# EAGLE design outin_shield_pi (EAGLE 7.3.0)
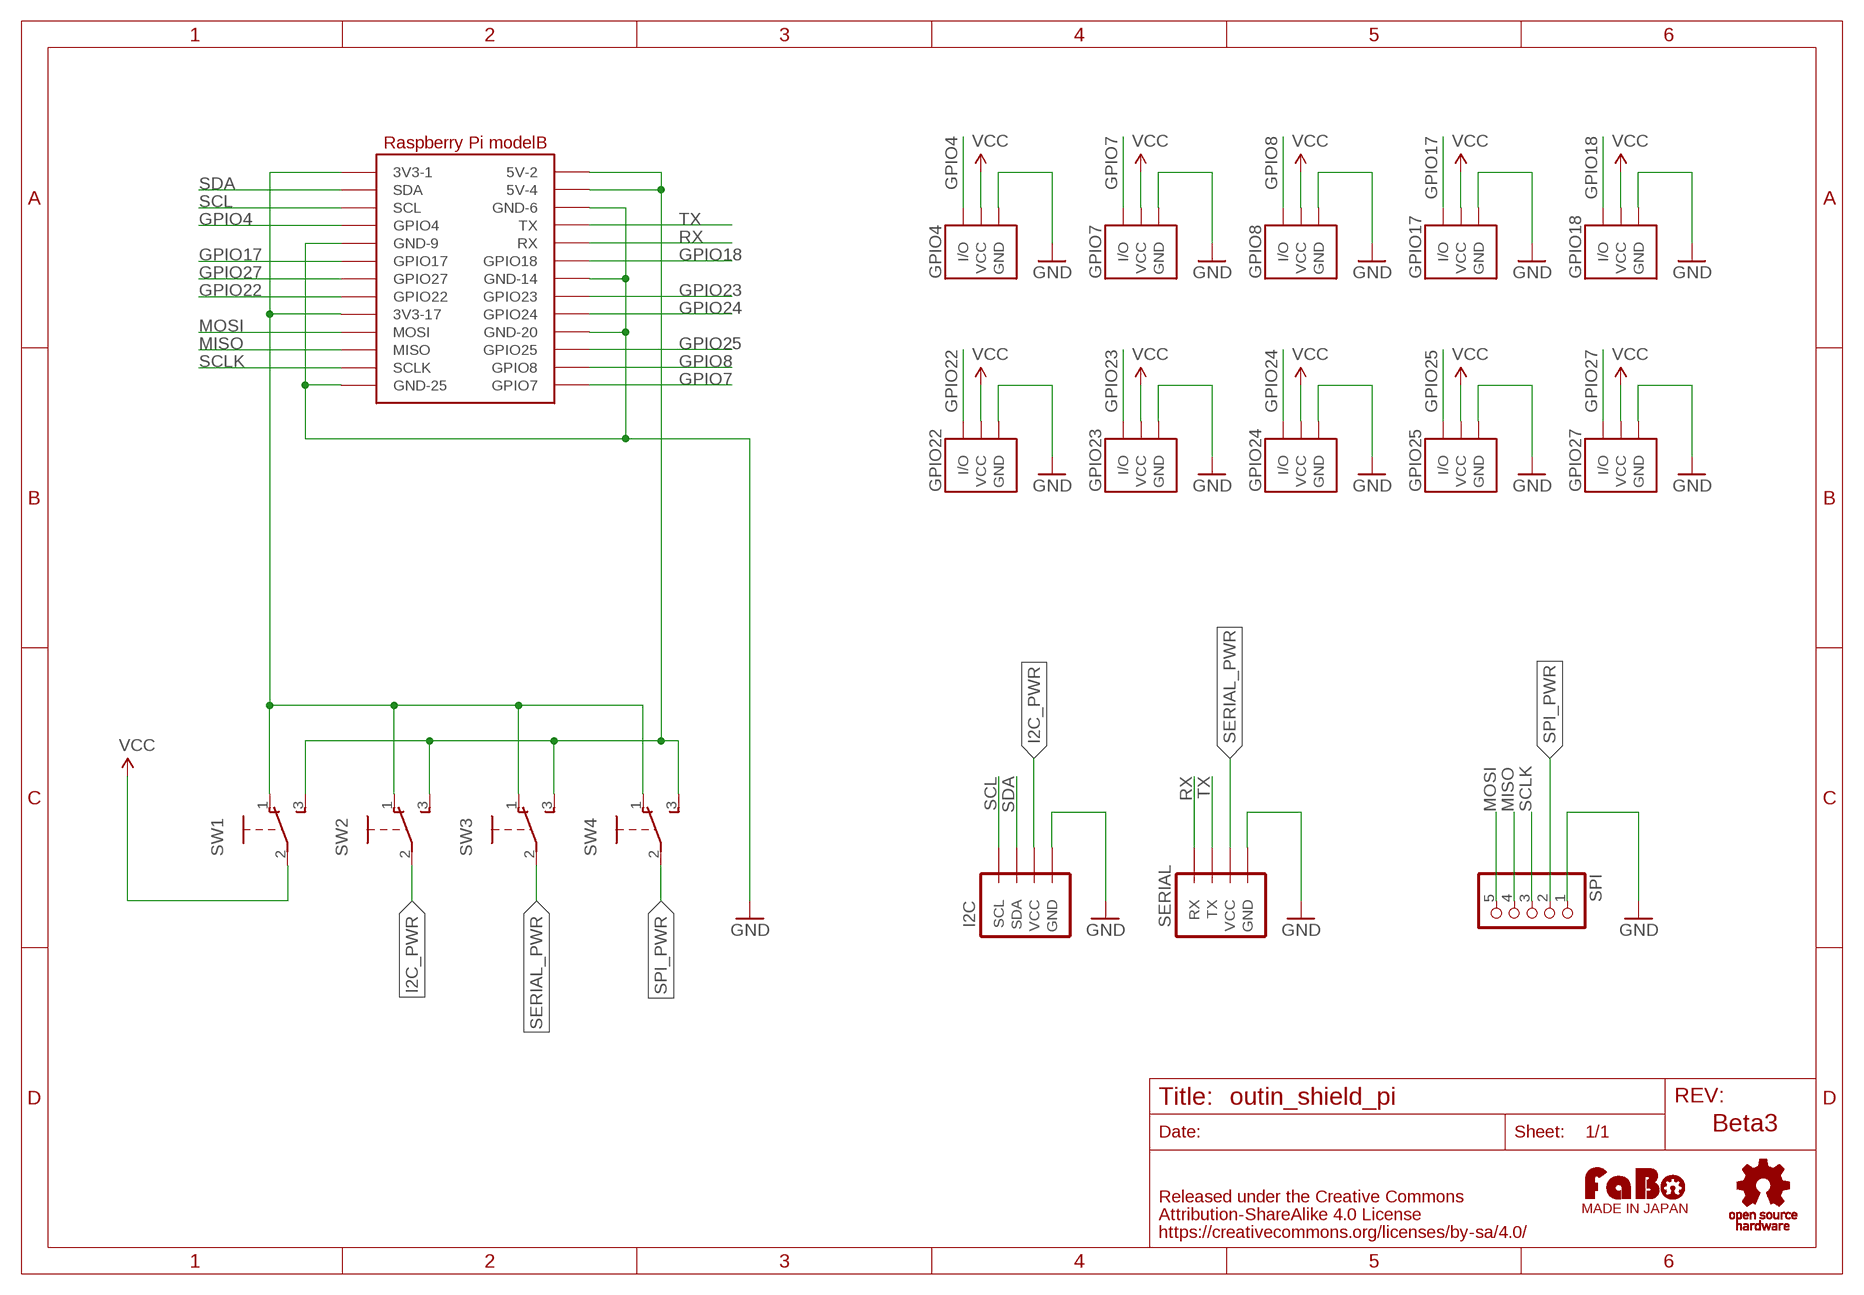
[diagram p0: schematic, sheet 1]

## Parts
GPIO4  IO_PIN-3PIN  [1X3-SNEAKY]
GPIO7  IO_PIN-3PIN  [1X3-SNEAKY]
GPIO8  IO_PIN-3PIN  [1X3-SNEAKY]
GPIO17  IO_PIN-3PIN  [1X3-SNEAKY]
GPIO18  IO_PIN-3PIN  [1X3-SNEAKY]
GPIO22  IO_PIN-3PIN  [1X3-SNEAKY]
GPIO23  IO_PIN-3PIN  [1X3-SNEAKY]
GPIO24  IO_PIN-3PIN  [1X3-SNEAKY]
GPIO25  IO_PIN-3PIN  [1X3-SNEAKY]
GPIO27  IO_PIN-3PIN  [1X3-SNEAKY]
I2C  BRICK_I2C_CONNECTOR  [BRICK_I2C_CONNECTOR]
SERIAL  BRICK_SERIAL_CONNECTOR  [BRICK_SERIAL_CONNECTOR]
SPI  PINHD-1X5  [1X05]
SW1  SWITCH-SLIDE-EG1218  [EG1218]
SW2  SWITCH-SLIDE-EG1218  [EG1218]
SW3  SWITCH-SLIDE-EG1218  [EG1218]
SW4  SWITCH-SLIDE-EG1218  [EG1218]
U1  RASPBERRY_PI_B1  [RASPBERRY_PI_B]
U$14  LOGO_FABO-M  [LOGO_FABO_M]
U$15  LOGO_OSHW_T-M  [LOGO_OSHW_T_M]

## Nets
3V3: SW1.1 SW2.1 SW3.1 SW4.1 U1.1(3V3-1) U1.17(3V3-17)
5V: SW1.3 SW2.3 SW3.3 SW4.3 U1.2(5V-2) U1.4(5V-4)
GND: GPIO4.1(GND) GPIO7.1(GND) GPIO8.1(GND) GPIO17.1(GND) GPIO18.1(GND) GPIO22.1(GND) GPIO23.1(GND) GPIO24.1(GND) GPIO25.1(GND) GPIO27.1(GND) I2C.GND SERIAL.GND SPI.1 U1.6(GND-6) U1.9(GND-9) U1.14(GND-14) U1.20(GND-20) U1.25(GND-25)
GPIO4: GPIO4.3(I/O) U1.7(GPIO4)
GPIO7: GPIO7.3(I/O) U1.26(GPIO7)
GPIO8: GPIO8.3(I/O) U1.24(GPIO8)
GPIO17: GPIO17.3(I/O) U1.11(GPIO17)
GPIO18: GPIO18.3(I/O) U1.12(GPIO18)
GPIO22: GPIO22.3(I/O) U1.15(GPIO22)
GPIO23: GPIO23.3(I/O) U1.16(GPIO23)
GPIO24: GPIO24.3(I/O) U1.18(GPIO24)
GPIO25: GPIO25.3(I/O) U1.22(GPIO25)
GPIO27: GPIO27.3(I/O) U1.13(GPIO27)
I2C_PWR: I2C.VCC SW2.2
MISO: SPI.4 U1.21(MISO)
MOSI: SPI.5 U1.19(MOSI)
RX: SERIAL.RX U1.10(RX)
SCL: I2C.SCL U1.5(SCL)
SCLK: SPI.3 U1.23(SCLK)
SDA: I2C.SDA U1.3(SDA)
SERIAL_PWR: SERIAL.VCC SW3.2
SPI_PWR: SPI.2 SW4.2
TX: SERIAL.TX U1.8(TX)
VCC: GPIO4.2(VCC) GPIO7.2(VCC) GPIO8.2(VCC) GPIO17.2(VCC) GPIO18.2(VCC) GPIO22.2(VCC) GPIO23.2(VCC) GPIO24.2(VCC) GPIO25.2(VCC) GPIO27.2(VCC) SW1.2

## Notes on the sheet
- Beta3
- MADE IN JAPAN

## Library data of the parts
GPIO4 GPIO7 GPIO8 GPIO17 GPIO18 GPIO22-GPIO25 GPIO27 = Gclue:IO_PIN
I2C = Gclue:BRICK_I2C_CONNECTOR: Brick Connector female for OUT/IN Shield
SERIAL = Gclue:BRICK_SERIAL_CONNECTOR
SPI = pinhead:PINHD-1X5: PIN HEADER
SW1-SW4 = Gclue:SWITCH-SLIDE
U1 = Gclue:RASPBERRY_PI_B
U$14 = FaBo:LOGO_FABO
U$15 = Gclue:LOGO_OSHW_T

## Net classes
0 default: width 0.254 mm

## Board
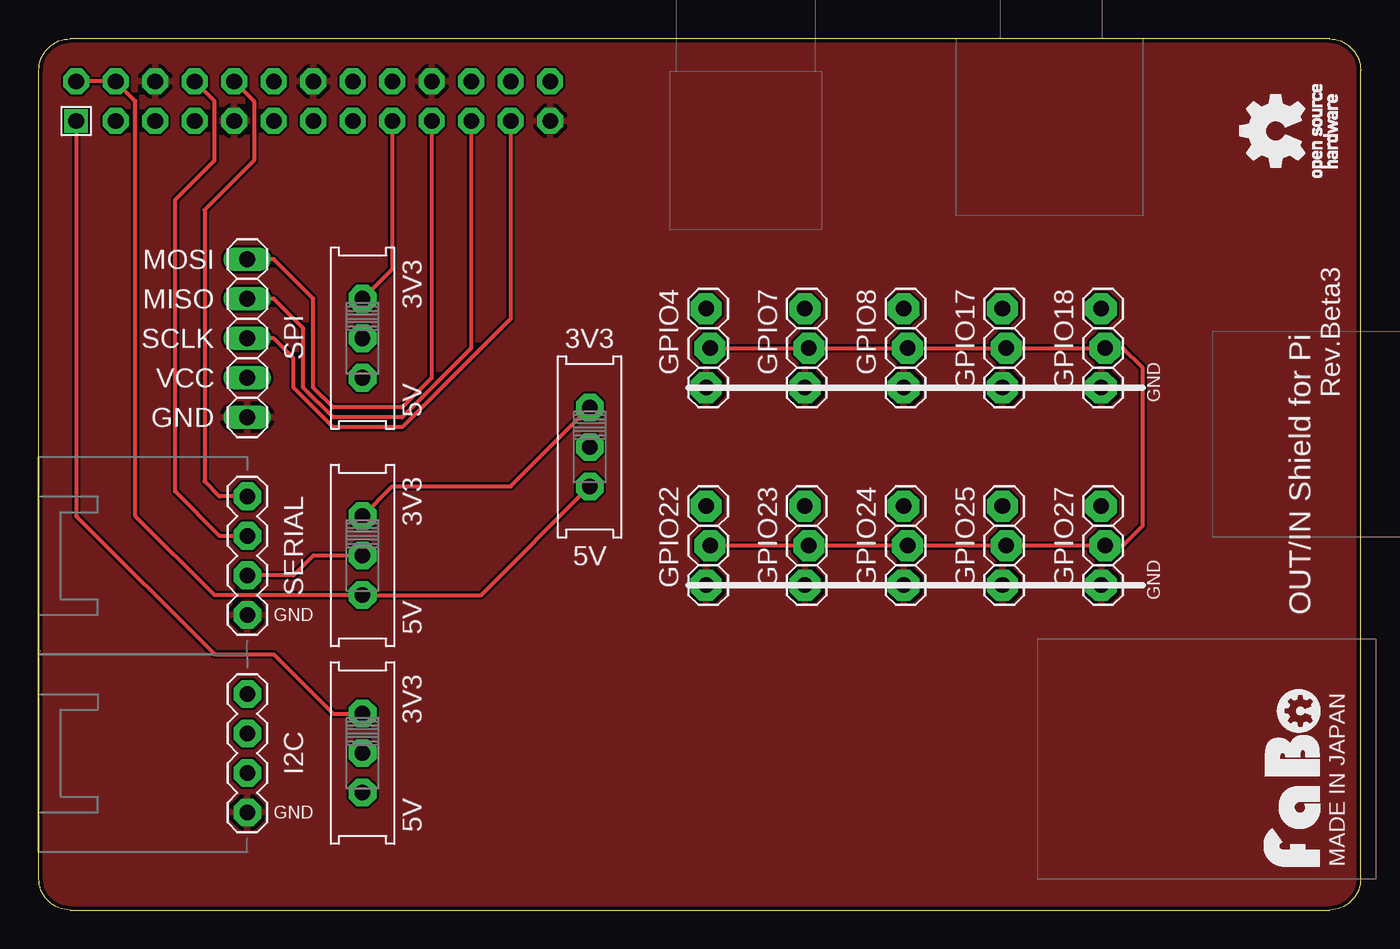
[diagram p1: board, top side]
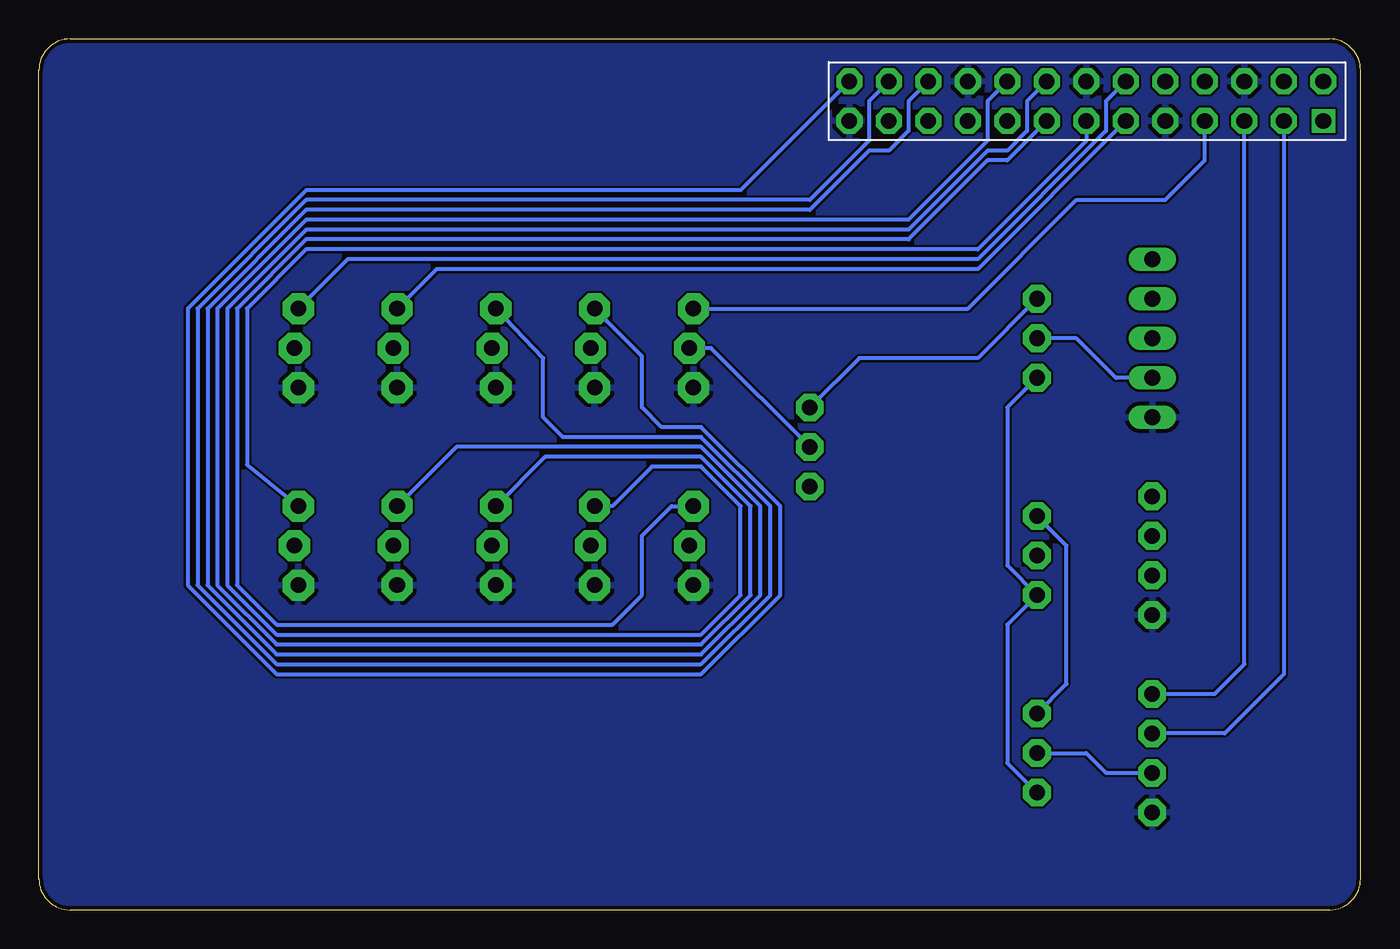
[diagram p2: board, bottom side, seen from below]

Size 85 x 56 mm. Coordinates in mm from the lower left corner, seen from the top.
Copper layers (1*16): Top 0.035mm / dielectric 1.5mm / Bottom 0.035mm
Design rules "Elecrow_2-layer_eagle_rule": minimum track width 6mil, minimum drill 12mil, track to track 6mil, track to pad 6mil, pad to pad 6mil, via to via 6mil, smd to smd 0mil, copper to edge 10mil, drill to drill 10mil, minimum pad ring 10mil, minimum via ring 6mil, stop-mask expansion 2mil, vias tented up to drill 100mil, thermal gap 10mil

### Footprints (pad centres in the part's own frame; a part is rotated, then mirrored left to right if it is on the bottom)
1X3-SNEAKY = drill 1 pad 2 octagon: 1 -2.54,0.127; 2 0,-0.127; 3 2.54,0.127
BRICK_I2C_CONNECTOR = drill 1 pad 1.778 octagon: GND -3.81,0; SCL 3.81,0; SDA 1.27,0; VCC -1.27,0
BRICK_SERIAL_CONNECTOR = drill 1 pad 1.778 octagon: GND -3.81,0; RX 3.81,0; TX 1.27,0; VCC -1.27,0
1X05 = drill 1.016 long: 1 -5.08,0; 2 -2.54,0; 3 0,0; 4 2.54,0; 5 5.08,0
EG1218 = drill 1 pad 1.778 octagon: 1 -2.54,0; 2 0,0; 3 2.54,0
RASPBERRY_PI_B = drill 1 square: 1 2.54,50.8 | drill 1 pad 1.676 octagon: 2 2.54,53.34; 3 5.08,50.8; 4 5.08,53.34; 5 7.62,50.8; 6 7.62,53.34; 7 10.16,50.8; 8 10.16,53.34; 9 12.7,50.8; 10 12.7,53.34; 11 15.24,50.8; 12 15.24,53.34; 13 17.78,50.8; 14 17.78,53.34; 15 20.32,50.8; 16 20.32,53.34; 17 22.86,50.8; 18 22.86,53.34; 19 25.4,50.8; 20 25.4,53.34; 21 27.94,50.8; 22 27.94,53.34; 23 30.48,50.8; 24 30.48,53.34; 25 33.02,50.8; 26 33.02,53.34

### Placement (x,y rotation side)
GPIO4  43.04,36.12 90 top
GPIO7  49.39,36.12 90 top
GPIO8  55.74,36.12 90 top
GPIO17  62.09,36.12 90 top
GPIO18  68.44,36.12 90 top
GPIO22  43.04,23.42 90 top
GPIO23  49.39,23.42 90 top
GPIO24  55.74,23.42 90 top
GPIO25  62.09,23.42 90 top
GPIO27  68.44,23.42 90 top
I2C  13.4,10.09 90 top
SERIAL  13.4,22.79 90 top
SPI  13.4,36.75 90 top
SW1  35.42,29.77 270 top
SW2  20.81,10.09 270 top
SW3  20.81,22.79 270 top
SW4  20.81,36.75 270 top
U1  -0.14,-0.07 0 top
U$14  82.41,8.5 90 top
U$15  79.55,50.09 90 top

### Tracks (layer width: path | path; a pad name or v marks a point on that pad's centre or on a via)
3V3
  Top 0.254: SW3.1 22.72,27.23 30.34,27.23 SW1.1 | U1.1 2.4,25.32 11.29,16.44 15.1,16.44 18.91,12.62 SW2.1 | U1.17 22.72,41.2 SW4.1
  Bottom 0.254: SW2.1 18.91,14.53 18.91,23.42 SW3.1 | SW4.1 24.62,35.48 32.24,35.48 SW1.1
5V
  Top 0.254: U1.2 U1.4 6.21,51.99 6.21,25.32 11.29,20.25 SW3.3 28.43,20.25 SW1.3
  Bottom 0.254: SW2.3 22.72,9.45 22.72,18.34 SW3.3 22.72,22.15 22.72,32.31 SW4.3
GND
  pour Bottom: -1.41,-1.34 86.22,-1.34 86.22,57.07 -1.41,57.07
  pour Top: -1.41,-1.34 86.22,-1.34 86.22,57.07 -1.41,57.07
GPIO4
  Bottom 0.254: GPIO4.3 25.26,38.66 18.27,45.64 12.56,45.64 10.02,48.18 U1.7
GPIO7
  Bottom 0.254: U1.26 39.87,46.28 67.8,46.28 75.42,38.66 75.42,20.88 69.71,15.17 42.41,15.17 37.33,20.25 37.33,25.96 42.41,31.04 44.95,31.04 46.21,32.31 46.21,35.61 GPIO7.3
GPIO8
  Bottom 0.254: U1.24 31.61,51.99 31.61,49.45 35.42,45.64 67.8,45.64 74.79,38.66 74.79,20.88 69.71,15.8 42.41,15.8 37.96,20.25 37.96,25.96 42.41,30.41 51.3,30.41 52.56,31.68 52.56,35.48 GPIO8.3
GPIO17
  Bottom 0.254: U1.11 24.62,41.2 59.42,41.2 GPIO17.3
GPIO18
  Bottom 0.254: U1.12 16.37,51.99 16.37,50.09 24.62,41.83 65.14,41.83 GPIO18.3
GPIO22
  Bottom 0.254: U1.15 22.72,48.18 23.99,48.18 29.07,43.1 67.8,43.1 72.25,38.66 72.25,20.88 69.71,18.34 48.12,18.34 46.21,20.25 46.21,24.05 44.31,25.96 GPIO22.3
GPIO23
  Bottom 0.254: U1.16 21.45,51.99 21.45,50.09 22.72,48.82 23.99,48.82 29.07,43.74 67.8,43.74 72.89,38.66 72.89,20.88 69.71,17.71 42.41,17.71 39.87,20.25 39.87,25.96 42.41,28.5 45.58,28.5 48.12,25.96 GPIO23.3
GPIO24
  Bottom 0.254: U1.18 23.99,51.99 23.99,49.45 29.07,44.38 67.8,44.38 73.52,38.66 73.52,20.88 69.71,17.07 42.41,17.07 39.23,20.25 39.23,25.96 42.41,29.14 52.44,29.14 GPIO24.3
GPIO25
  Bottom 0.254: U1.22 29.07,51.99 29.07,50.09 30.34,48.82 31.61,48.82 35.42,45.01 67.8,45.01 74.16,38.66 74.16,20.88 69.71,16.44 42.41,16.44 38.59,20.25 38.59,25.96 42.41,29.77 58.15,29.77 GPIO25.3
GPIO27
  Bottom 0.254: U1.13 17.64,49.45 24.62,42.47 67.8,42.47 71.61,38.66 71.61,28.63 GPIO27.3
I2C_PWR
  Bottom 0.254: SW2.2 17.64,10.09 16.37,8.82 I2C.VCC
MISO
  Top 0.254: U1.21 27.8,36.12 23.36,31.68 18.91,31.68 17,33.58 17,37.39 15.1,39.29 SPI.4
MOSI
  Top 0.254: U1.19 25.26,34.21 23.36,32.31 18.91,32.31 17.64,33.58 17.64,39.29 15.1,41.83 SPI.5
RX
  Top 0.254: U1.10 13.83,51.99 13.83,48.18 10.65,45.01 10.65,27.55 11.61,26.6 SERIAL.RX
SCL
  Bottom 0.254: I2C.SCL 9.38,13.9 7.48,15.8 U1.5
SCLK
  Top 0.254: U1.23 30.34,38.02 23.36,31.04 18.91,31.04 16.37,33.58 16.37,35.48 15.1,36.75 SPI.3
SDA
  Bottom 0.254: U1.3 4.94,15.17 8.75,11.36 I2C.SDA
SERIAL_PWR
  Top 0.254: SW3.2 17.64,22.79 16.37,21.52 SERIAL.VCC
SPI_PWR
  Bottom 0.254: SPI.2 15.73,34.21 18.27,36.75 SW4.2
TX
  Top 0.254: U1.8 11.29,51.99 11.29,48.18 8.75,45.64 8.75,26.91 11.61,24.05 SERIAL.TX
VCC
  Top 0.254: GPIO22.2 GPIO23.2 GPIO24.2 GPIO25.2 GPIO27.2 69.71,23.42 70.98,24.69 70.98,34.85 69.71,36.12 GPIO18.2 GPIO17.2 GPIO8.2 GPIO7.2 GPIO4.2
  Bottom 0.254: SW1.2 41.77,36.12 GPIO4.2

### Text on the board
tPlace: MOSI | 3V3 | MISO | SCLK | SPI | 3V3 | VCC | GND | Rev.Beta3 | GND | 5V | 3V3 | SERIAL | 5V | GND | GND | OUT/IN Shield for Pi | 5V | 3V3 | I2C | GND | 5V | MADE IN JAPAN